# Altium schematic sheet Top.SchDoc: HPBI Controller (part 1 of 2)
size C; ApprovedBy: J Johnson; CheckedBy: J Johnson; Author: sdfasdfdfAEFfasdFfaF; DrawnBy: J Johnson; Organization: Opsero Electronic Design; Address1: 21-915 Av. Marguerite-Bourgeoys; Address2: Québec (QC); Address3: G1S 3X4; DocumentNumber: OP009-001-SCH; Revision: 1.0; SheetNumber: 01; SheetTotal: 16; Tel1: (581) 308-8830; Tel2: (581) 308-8830; Project: HPBI Controller; CheckedDate: yyyy-mm-dd; Sheet: Block diagram; PageSetup: Record=PageOptions|CenterHorizontal=True|CenterVertical=True|PrintScale=1.08|XCorrection=1.00|YCorrection=1.00|PrintKind=0|BorderSize=5000000|LeftOffset=0|BottomOffset=0|Orientation=2|PaperLength=1000|PaperWidth=1000|Scale=100|PaperSource=7|PrintQuality=-4|MediaType=1|DitherType=10|PaperKind=Tabloid     [11 x 17 in]|PrintScaleMode=1; DrawDate: 2013-12-13; SchTitle: HPBI Controller; RevDescription: Preliminary; RevDate: 2014-01-29; RevBy: J Johnson
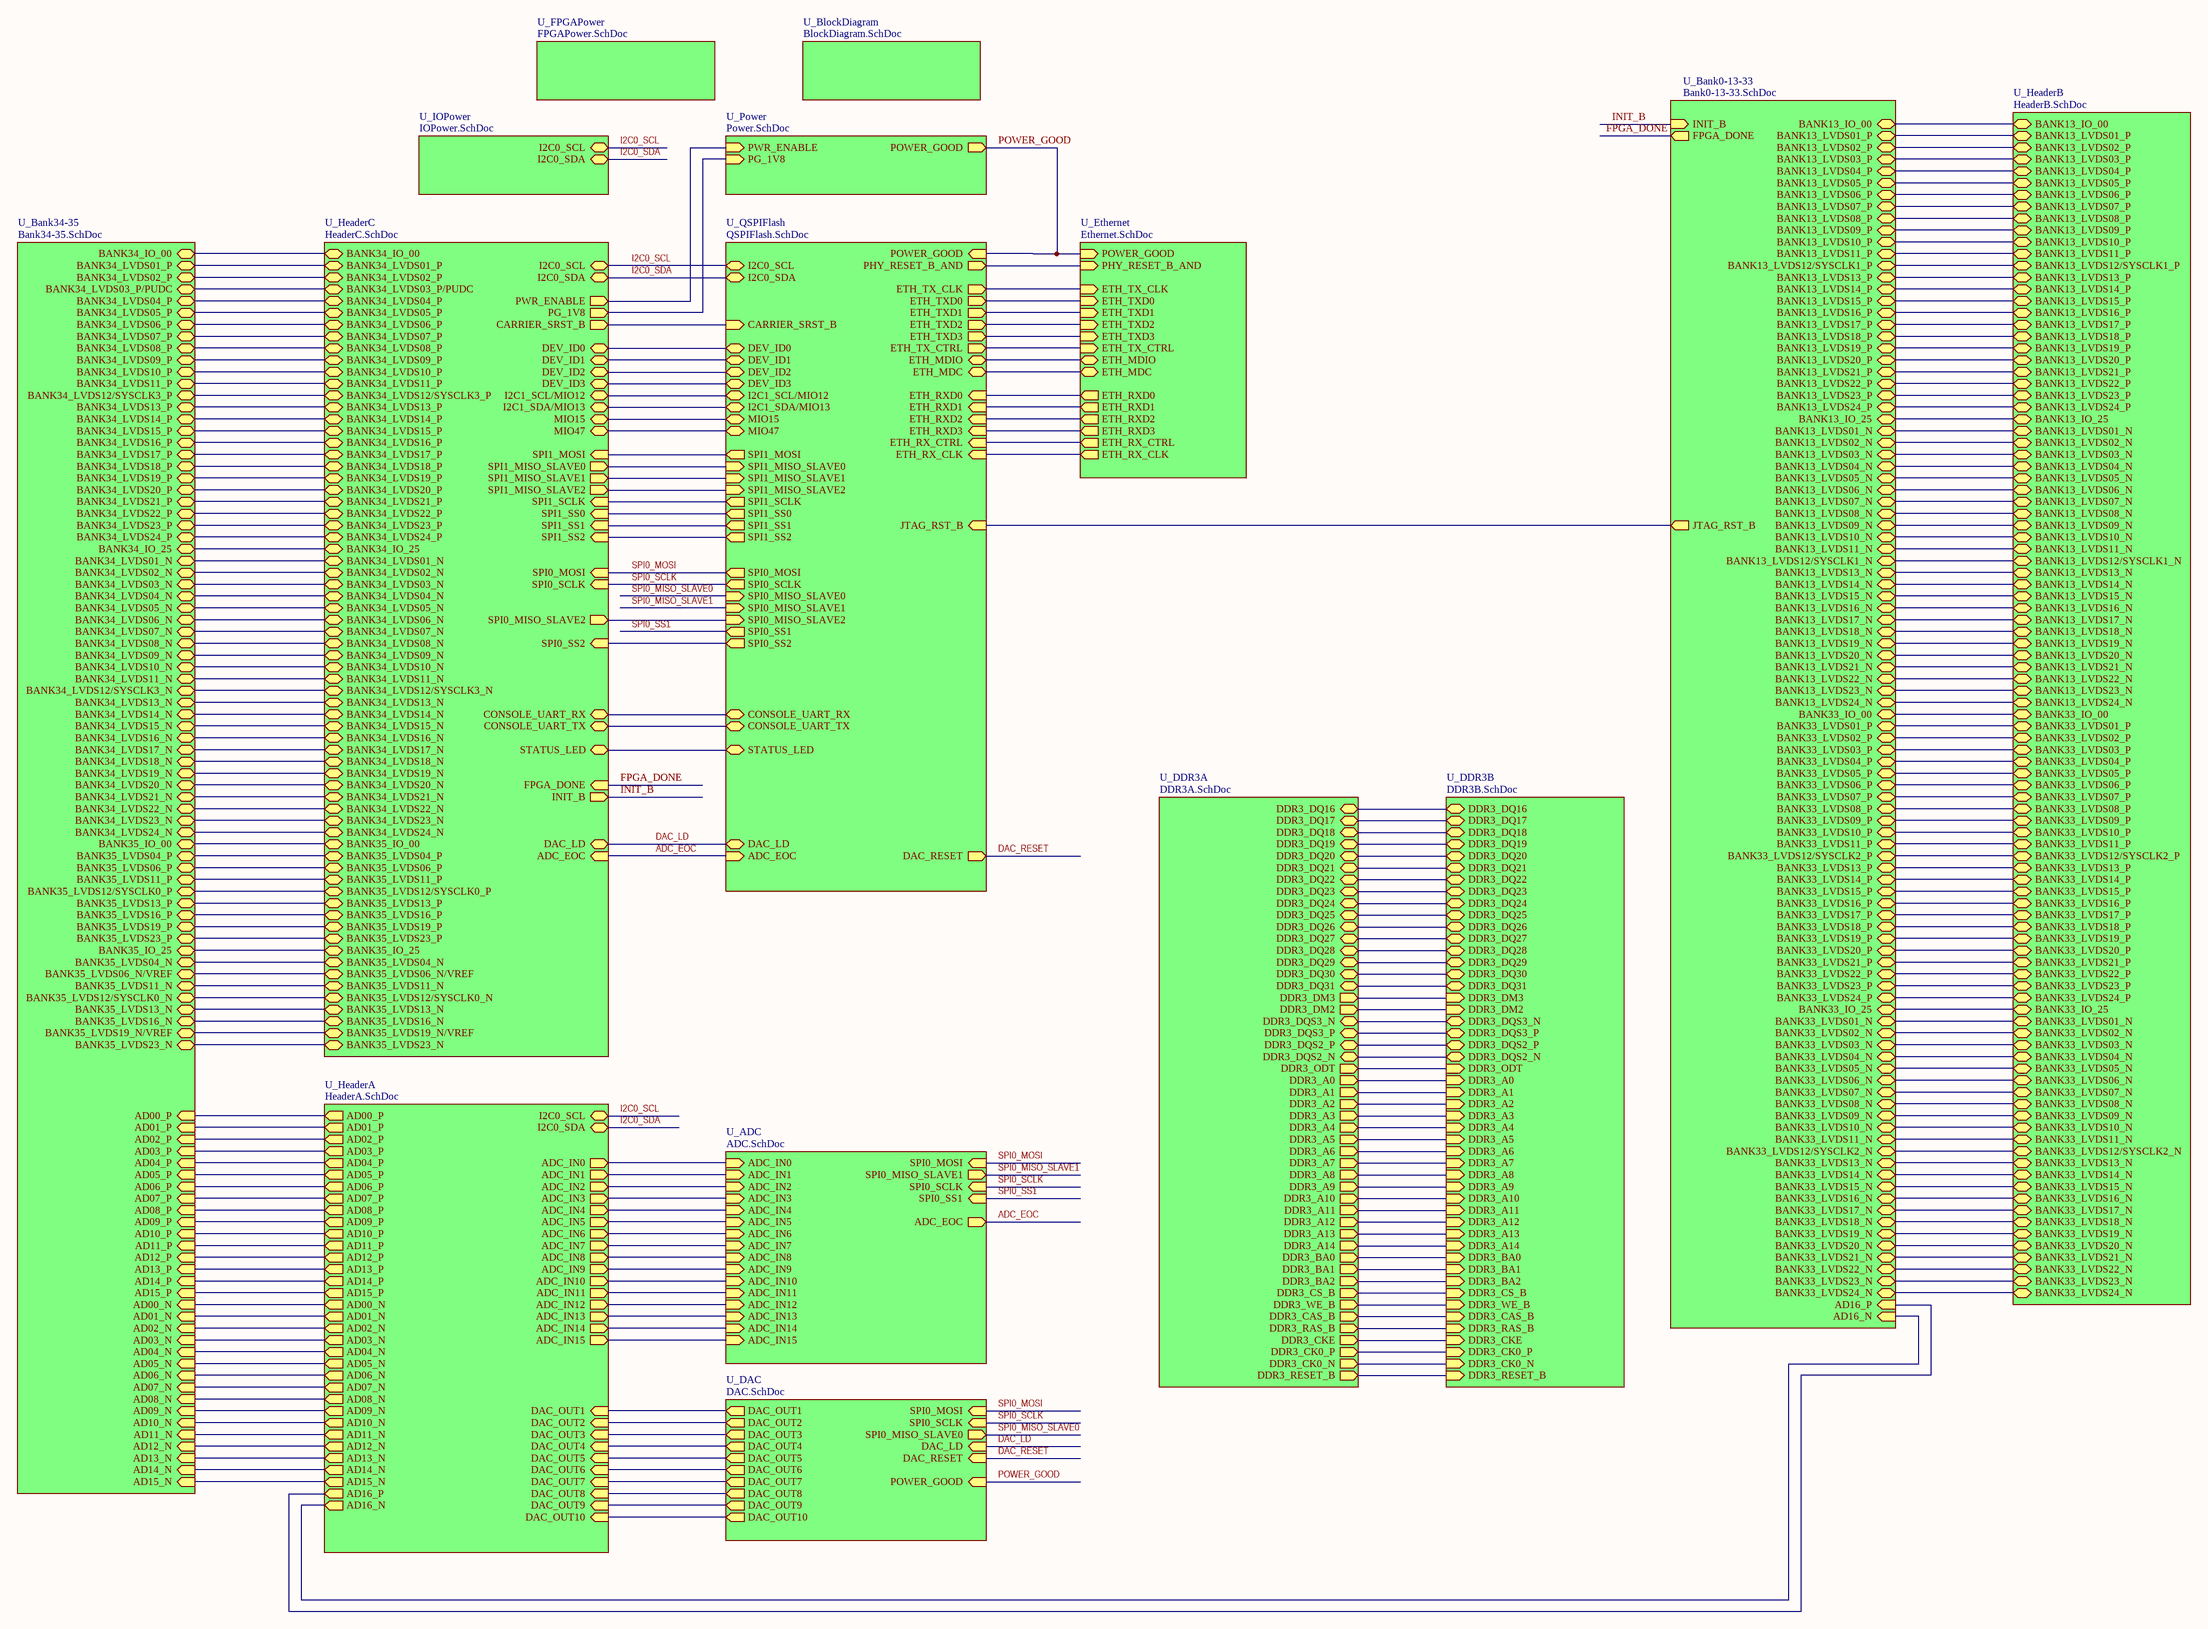
[diagram p0: Top.SchDoc]

## Sub-sheets
U_ADC = ADC.SchDoc: SPI0_MOSI (in), SPI0_MISO_SLAVE1 (out), SPI0_SCLK (in), SPI0_SS1 (in), ADC_IN0 (in), ADC_IN1 (in), ADC_IN2 (in), ADC_IN3 (in), ADC_IN4 (in), ADC_IN5 (in), ADC_IN6 (in), ADC_IN7 (in), ADC_IN8 (in), ADC_IN9 (in), ADC_IN10 (in), ADC_IN11 (in), ADC_IN12 (in), ADC_IN13 (in), ADC_IN14 (in), ADC_IN15 (in), ADC_EOC (out)
U_Bank0-13-33 = Bank0-13-33.SchDoc: FPGA_DONE (out), INIT_B (in), BANK13_IO_00 (bidir), BANK13_LVDS01_P (bidir), BANK13_LVDS02_P (bidir), BANK13_LVDS03_P (bidir), BANK13_LVDS04_P (bidir), BANK13_LVDS05_P (bidir), BANK13_LVDS06_P (bidir), BANK13_LVDS07_P (bidir), BANK13_LVDS08_P (bidir), BANK13_LVDS09_P (bidir), BANK13_LVDS10_P (bidir), BANK13_LVDS11_P (bidir), BANK13_LVDS13_P (bidir), BANK13_LVDS14_P (bidir), BANK13_LVDS15_P (bidir), BANK13_LVDS16_P (bidir), BANK13_LVDS17_P (bidir), BANK13_LVDS18_P (bidir), BANK13_LVDS19_P (bidir), BANK13_LVDS20_P (bidir), BANK13_LVDS21_P (bidir), BANK13_LVDS22_P (bidir), BANK13_LVDS23_P (bidir), BANK13_LVDS24_P (bidir), BANK13_IO_25 (bidir), BANK13_LVDS01_N (bidir), BANK13_LVDS02_N (bidir), BANK13_LVDS03_N (bidir), BANK13_LVDS04_N (bidir), BANK13_LVDS05_N (bidir), BANK13_LVDS06_N (bidir), BANK13_LVDS07_N (bidir), BANK13_LVDS08_N (bidir), BANK13_LVDS09_N (bidir), BANK13_LVDS10_N (bidir), BANK13_LVDS11_N (bidir), BANK13_LVDS13_N (bidir), BANK13_LVDS14_N (bidir), BANK13_LVDS15_N (bidir), BANK13_LVDS16_N (bidir), BANK13_LVDS17_N (bidir), BANK13_LVDS18_N (bidir), BANK13_LVDS19_N (bidir), BANK13_LVDS20_N (bidir), BANK13_LVDS21_N (bidir), BANK13_LVDS22_N (bidir), BANK13_LVDS23_N (bidir), BANK13_LVDS24_N (bidir), BANK33_IO_00 (bidir), BANK33_LVDS01_P (bidir), BANK33_LVDS02_P (bidir), BANK33_LVDS03_P (bidir), BANK33_LVDS04_P (bidir), BANK33_LVDS05_P (bidir), BANK33_LVDS06_P (bidir), BANK33_LVDS07_P (bidir), BANK33_LVDS08_P (bidir), BANK33_LVDS09_P (bidir), BANK33_LVDS10_P (bidir), BANK33_LVDS11_P (bidir), BANK33_LVDS13_P (bidir), BANK33_LVDS14_P (bidir), BANK33_LVDS15_P (bidir), BANK33_LVDS16_P (bidir), BANK33_LVDS17_P (bidir), BANK33_LVDS18_P (bidir), BANK33_LVDS19_P (bidir), BANK33_LVDS20_P (bidir), BANK33_LVDS21_P (bidir), BANK33_LVDS22_P (bidir), BANK33_LVDS23_P (bidir), BANK33_LVDS24_P (bidir), BANK33_IO_25 (bidir), BANK33_LVDS01_N (bidir), BANK33_LVDS02_N (bidir), BANK33_LVDS03_N (bidir), BANK33_LVDS04_N (bidir), BANK33_LVDS05_N (bidir), BANK33_LVDS06_N (bidir), BANK33_LVDS07_N (bidir), BANK33_LVDS08_N (bidir), BANK33_LVDS09_N (bidir), BANK33_LVDS10_N (bidir), BANK33_LVDS11_N (bidir), BANK33_LVDS13_N (bidir), BANK33_LVDS14_N (bidir), BANK33_LVDS15_N (bidir), BANK33_LVDS16_N (bidir), BANK33_LVDS17_N (bidir), BANK33_LVDS18_N (bidir), BANK33_LVDS19_N (bidir), BANK33_LVDS20_N (bidir), BANK33_LVDS21_N (bidir), BANK33_LVDS22_N (bidir), BANK33_LVDS23_N (bidir), BANK33_LVDS24_N (bidir), AD16_P (in), AD16_N (in), JTAG_RST_B (out), BANK13_LVDS12/SYSCLK1_P (bidir), BANK13_LVDS12/SYSCLK1_N (bidir), BANK33_LVDS12/SYSCLK2_P (bidir), BANK33_LVDS12/SYSCLK2_N (bidir)
U_Bank34-35 = Bank34-35.SchDoc: BANK34_IO_00 (bidir), BANK34_LVDS01_P (bidir), BANK34_LVDS02_P (bidir), BANK34_LVDS03_P/PUDC (bidir), BANK34_LVDS04_P (bidir), BANK34_LVDS05_P (bidir), BANK34_LVDS06_P (bidir), BANK34_LVDS07_P (bidir), BANK34_LVDS08_P (bidir), BANK34_LVDS09_P (bidir), BANK34_LVDS10_P (bidir), BANK34_LVDS11_P (bidir), BANK34_LVDS13_P (bidir), BANK34_LVDS14_P (bidir), BANK34_LVDS15_P (bidir), BANK34_LVDS16_P (bidir), BANK34_LVDS17_P (bidir), BANK34_LVDS18_P (bidir), BANK34_LVDS19_P (bidir), BANK34_LVDS20_P (bidir), BANK34_LVDS21_P (bidir), BANK34_LVDS22_P (bidir), BANK34_LVDS23_P (bidir), BANK34_LVDS24_P (bidir), BANK34_IO_25 (bidir), BANK34_LVDS01_N (bidir), BANK34_LVDS02_N (bidir), BANK34_LVDS03_N (bidir), BANK34_LVDS04_N (bidir), BANK34_LVDS05_N (bidir), BANK34_LVDS06_N (bidir), BANK34_LVDS07_N (bidir), BANK34_LVDS08_N (bidir), BANK34_LVDS09_N (bidir), BANK34_LVDS10_N (bidir), BANK34_LVDS11_N (bidir), BANK34_LVDS13_N (bidir), BANK34_LVDS14_N (bidir), BANK34_LVDS15_N (bidir), BANK34_LVDS16_N (bidir), BANK34_LVDS17_N (bidir), BANK34_LVDS18_N (bidir), BANK34_LVDS19_N (bidir), BANK34_LVDS20_N (bidir), BANK34_LVDS21_N (bidir), BANK34_LVDS22_N (bidir), BANK34_LVDS23_N (bidir), BANK34_LVDS24_N (bidir), BANK35_IO_00 (bidir), BANK35_LVDS04_P (bidir), BANK35_LVDS06_P (bidir), BANK35_LVDS11_P (bidir), BANK35_LVDS13_P (bidir), BANK35_LVDS16_P (bidir), BANK35_LVDS19_P (bidir), BANK35_LVDS23_P (bidir), BANK35_IO_25 (bidir), BANK35_LVDS04_N (bidir), BANK35_LVDS06_N/VREF (bidir), BANK35_LVDS11_N (bidir), BANK35_LVDS13_N (bidir), BANK35_LVDS16_N (bidir), BANK35_LVDS19_N/VREF (bidir), BANK35_LVDS23_N (bidir), AD00_P (in), AD01_P (in), AD02_P (in), AD03_P (in), AD04_P (in), AD05_P (in), AD06_P (in), AD07_P (in), AD08_P (in), AD09_P (in), AD10_P (in), AD11_P (in), AD12_P (in), AD13_P (in), AD14_P (in), AD15_P (in), AD00_N (in), AD01_N (in), AD02_N (in), AD03_N (in), AD04_N (in), AD05_N (in), AD06_N (in), AD07_N (in), AD08_N (in), AD09_N (in), AD10_N (in), AD11_N (in), AD12_N (in), AD13_N (in), AD14_N (in), AD15_N (in), BANK34_LVDS12/SYSCLK3_P (bidir), BANK34_LVDS12/SYSCLK3_N (bidir), BANK35_LVDS12/SYSCLK0_P (bidir), BANK35_LVDS12/SYSCLK0_N (bidir)
U_BlockDiagram = BlockDiagram.SchDoc: no entries
U_DAC = DAC.SchDoc: DAC_OUT1 (out), DAC_OUT2 (out), DAC_OUT3 (out), DAC_OUT4 (out), DAC_OUT5 (out), DAC_OUT6 (out), DAC_OUT7 (out), DAC_OUT8 (out), DAC_OUT9 (out), DAC_OUT10 (out), SPI0_MOSI (in), SPI0_SCLK (in), DAC_LD (in), POWER_GOOD (in), SPI0_MISO_SLAVE0 (out), DAC_RESET (in)
U_DDR3A = DDR3A.SchDoc: DDR3_DQ16 (bidir), DDR3_DQ17 (bidir), DDR3_DQ18 (bidir), DDR3_DQ19 (bidir), DDR3_DQ20 (bidir), DDR3_DQ21 (bidir), DDR3_DQ22 (bidir), DDR3_DQ23 (bidir), DDR3_DQ24 (bidir), DDR3_DQ25 (bidir), DDR3_DQ26 (bidir), DDR3_DQ27 (bidir), DDR3_DQ28 (bidir), DDR3_DQ29 (bidir), DDR3_DQ30 (bidir), DDR3_DQ31 (bidir), DDR3_DM2 (out), DDR3_DM3 (out), DDR3_DQS2_P (bidir), DDR3_DQS2_N (bidir), DDR3_DQS3_N (bidir), DDR3_DQS3_P (bidir), DDR3_A0 (out), DDR3_A1 (out), DDR3_A2 (out), DDR3_A3 (out), DDR3_A4 (out), DDR3_A5 (out), DDR3_A6 (out), DDR3_A7 (out), DDR3_A8 (out), DDR3_A9 (out), DDR3_A10 (out), DDR3_A11 (out), DDR3_A12 (out), DDR3_A13 (out), DDR3_A14 (out), DDR3_BA0 (out), DDR3_BA1 (out), DDR3_BA2 (out), DDR3_CK0_P (out), DDR3_CK0_N (out), DDR3_CKE (out), DDR3_CS_B (out), DDR3_RAS_B (out), DDR3_CAS_B (out), DDR3_WE_B (out), DDR3_ODT (out), DDR3_RESET_B (out)
U_DDR3B = DDR3B.SchDoc: DDR3_DQ24 (bidir), DDR3_DQ25 (bidir), DDR3_DQ26 (bidir), DDR3_DQ27 (bidir), DDR3_DQ28 (bidir), DDR3_DQ29 (bidir), DDR3_DQ30 (bidir), DDR3_DQ31 (bidir), DDR3_DQ16 (bidir), DDR3_DQ17 (bidir), DDR3_DQ18 (bidir), DDR3_DQ19 (bidir), DDR3_DQ20 (bidir), DDR3_DQ21 (bidir), DDR3_DQ22 (bidir), DDR3_DQ23 (bidir), DDR3_DM3 (in), DDR3_DM2 (in), DDR3_DQS3_N (bidir), DDR3_DQS3_P (bidir), DDR3_DQS2_P (bidir), DDR3_DQS2_N (bidir), DDR3_ODT (in), DDR3_A0 (in), DDR3_A1 (in), DDR3_A2 (in), DDR3_A3 (in), DDR3_A4 (in), DDR3_A5 (in), DDR3_A6 (in), DDR3_A7 (in), DDR3_A8 (in), DDR3_A9 (in), DDR3_A10 (in), DDR3_A11 (in), DDR3_A12 (in), DDR3_A13 (in), DDR3_A14 (in), DDR3_BA0 (in), DDR3_BA1 (in), DDR3_BA2 (in), DDR3_CS_B (in), DDR3_WE_B (in), DDR3_CAS_B (in), DDR3_RAS_B (in), DDR3_CKE (in), DDR3_CK0_P (in), DDR3_CK0_N (in), DDR3_RESET_B (in)
U_Ethernet = Ethernet.SchDoc: POWER_GOOD (in), ETH_TX_CLK (in), ETH_TXD0 (in), ETH_TXD1 (in), ETH_TXD2 (in), ETH_TXD3 (in), ETH_RXD0 (out), ETH_RXD1 (out), ETH_RXD2 (out), ETH_RXD3 (out), ETH_TX_CTRL (in), ETH_RX_CTRL (out), ETH_RX_CLK (out), ETH_MDIO (bidir), ETH_MDC (bidir), PHY_RESET_B_AND (in)
U_FPGAPower = FPGAPower.SchDoc: no entries
U_HeaderA = HeaderA.SchDoc: AD00_P (out), AD01_P (out), AD02_P (out), AD03_P (out), AD04_P (out), AD05_P (out), AD06_P (out), AD07_P (out), AD08_P (out), AD09_P (out), AD10_P (out), AD11_P (out), AD12_P (out), AD13_P (out), AD14_P (out), AD15_P (out), AD00_N (out), AD01_N (out), AD02_N (out), AD03_N (out), AD04_N (out), AD05_N (out), AD06_N (out), AD07_N (out), AD08_N (out), AD09_N (out), AD10_N (out), AD11_N (out), AD12_N (out), AD13_N (out), AD14_N (out), AD15_N (out), AD16_P (out), AD16_N (out), DAC_OUT1 (in), DAC_OUT2 (in), DAC_OUT3 (in), DAC_OUT4 (in), DAC_OUT5 (in), DAC_OUT6 (in), DAC_OUT7 (in), DAC_OUT8 (in), DAC_OUT9 (in), DAC_OUT10 (in), ADC_IN0 (out), ADC_IN1 (out), ADC_IN2 (out), ADC_IN3 (out), ADC_IN4 (out), ADC_IN5 (out), ADC_IN6 (out), ADC_IN7 (out), ADC_IN8 (out), ADC_IN9 (out), ADC_IN10 (out), ADC_IN11 (out), ADC_IN12 (out), ADC_IN13 (out), ADC_IN14 (out), ADC_IN15 (out), I2C0_SCL (bidir), I2C0_SDA (bidir)
U_HeaderB = HeaderB.SchDoc: BANK13_IO_00 (bidir), BANK13_LVDS01_P (bidir), BANK13_LVDS02_P (bidir), BANK13_LVDS03_P (bidir), BANK13_LVDS04_P (bidir), BANK13_LVDS05_P (bidir), BANK13_LVDS06_P (bidir), BANK13_LVDS07_P (bidir), BANK13_LVDS08_P (bidir), BANK13_LVDS09_P (bidir), BANK13_LVDS10_P (bidir), BANK13_LVDS11_P (bidir), BANK13_LVDS12/SYSCLK1_P (bidir), BANK13_LVDS13_P (bidir), BANK13_LVDS14_P (bidir), BANK13_LVDS15_P (bidir), BANK13_LVDS16_P (bidir), BANK13_LVDS17_P (bidir), BANK13_LVDS18_P (bidir), BANK13_LVDS19_P (bidir), BANK13_LVDS20_P (bidir), BANK13_LVDS21_P (bidir), BANK13_LVDS22_P (bidir), BANK13_LVDS23_P (bidir), BANK13_LVDS24_P (bidir), BANK13_IO_25 (bidir), BANK13_LVDS01_N (bidir), BANK13_LVDS02_N (bidir), BANK13_LVDS03_N (bidir), BANK13_LVDS04_N (bidir), BANK13_LVDS05_N (bidir), BANK13_LVDS06_N (bidir), BANK13_LVDS07_N (bidir), BANK13_LVDS08_N (bidir), BANK13_LVDS09_N (bidir), BANK13_LVDS10_N (bidir), BANK13_LVDS11_N (bidir), BANK13_LVDS12/SYSCLK1_N (bidir), BANK13_LVDS13_N (bidir), BANK13_LVDS14_N (bidir), BANK13_LVDS15_N (bidir), BANK13_LVDS16_N (bidir), BANK13_LVDS17_N (bidir), BANK13_LVDS18_N (bidir), BANK13_LVDS19_N (bidir), BANK13_LVDS20_N (bidir), BANK13_LVDS21_N (bidir), BANK13_LVDS22_N (bidir), BANK13_LVDS23_N (bidir), BANK13_LVDS24_N (bidir), BANK33_IO_00 (bidir), BANK33_LVDS01_P (bidir), BANK33_LVDS02_P (bidir), BANK33_LVDS03_P (bidir), BANK33_LVDS04_P (bidir), BANK33_LVDS05_P (bidir), BANK33_LVDS06_P (bidir), BANK33_LVDS07_P (bidir), BANK33_LVDS08_P (bidir), BANK33_LVDS09_P (bidir), BANK33_LVDS10_P (bidir), BANK33_LVDS11_P (bidir), BANK33_LVDS12/SYSCLK2_P (bidir), BANK33_LVDS13_P (bidir), BANK33_LVDS14_P (bidir), BANK33_LVDS15_P (bidir), BANK33_LVDS16_P (bidir), BANK33_LVDS17_P (bidir), BANK33_LVDS18_P (bidir), BANK33_LVDS19_P (bidir), BANK33_LVDS20_P (bidir), BANK33_LVDS21_P (bidir), BANK33_LVDS22_P (bidir), BANK33_LVDS23_P (bidir), BANK33_LVDS24_P (bidir), BANK33_IO_25 (bidir), BANK33_LVDS01_N (bidir), BANK33_LVDS02_N (bidir), BANK33_LVDS03_N (bidir), BANK33_LVDS04_N (bidir), BANK33_LVDS05_N (bidir), BANK33_LVDS06_N (bidir), BANK33_LVDS07_N (bidir), BANK33_LVDS08_N (bidir), BANK33_LVDS09_N (bidir), BANK33_LVDS10_N (bidir), BANK33_LVDS11_N (bidir), BANK33_LVDS12/SYSCLK2_N (bidir), BANK33_LVDS13_N (bidir), BANK33_LVDS14_N (bidir), BANK33_LVDS15_N (bidir), BANK33_LVDS16_N (bidir), BANK33_LVDS17_N (bidir), BANK33_LVDS18_N (bidir), BANK33_LVDS19_N (bidir), BANK33_LVDS20_N (bidir), BANK33_LVDS21_N (bidir), BANK33_LVDS22_N (bidir), BANK33_LVDS23_N (bidir), BANK33_LVDS24_N (bidir)
U_HeaderC = HeaderC.SchDoc: BANK34_IO_00 (bidir), BANK34_LVDS01_P (bidir), BANK34_LVDS02_P (bidir), BANK34_LVDS03_P/PUDC (bidir), BANK34_LVDS04_P (bidir), BANK34_LVDS05_P (bidir), BANK34_LVDS06_P (bidir), BANK34_LVDS07_P (bidir), BANK34_LVDS08_P (bidir), BANK34_LVDS09_P (bidir), BANK34_LVDS10_P (bidir), BANK34_LVDS11_P (bidir), BANK34_LVDS12/SYSCLK3_P (bidir), BANK34_LVDS13_P (bidir), BANK34_LVDS14_P (bidir), BANK34_LVDS15_P (bidir), BANK34_LVDS16_P (bidir), BANK34_LVDS17_P (bidir), BANK34_LVDS18_P (bidir), BANK34_LVDS19_P (bidir), BANK34_LVDS20_P (bidir), BANK34_LVDS21_P (bidir), BANK34_LVDS22_P (bidir), BANK34_LVDS23_P (bidir), BANK34_LVDS24_P (bidir), BANK34_IO_25 (bidir), BANK34_LVDS01_N (bidir), BANK34_LVDS02_N (bidir), BANK34_LVDS03_N (bidir), BANK34_LVDS04_N (bidir), BANK34_LVDS05_N (bidir), BANK34_LVDS06_N (bidir), BANK34_LVDS07_N (bidir), BANK34_LVDS08_N (bidir), BANK34_LVDS09_N (bidir), BANK34_LVDS10_N (bidir), BANK34_LVDS11_N (bidir), BANK34_LVDS12/SYSCLK3_N (bidir), BANK34_LVDS13_N (bidir), BANK34_LVDS14_N (bidir), BANK34_LVDS15_N (bidir), BANK34_LVDS16_N (bidir), BANK34_LVDS17_N (bidir), BANK34_LVDS18_N (bidir), BANK34_LVDS19_N (bidir), BANK34_LVDS20_N (bidir), BANK34_LVDS21_N (bidir), BANK34_LVDS22_N (bidir), BANK34_LVDS23_N (bidir), BANK34_LVDS24_N (bidir), BANK35_IO_00 (bidir), BANK35_LVDS04_P (bidir), BANK35_LVDS06_P (bidir), BANK35_LVDS11_P (bidir), BANK35_LVDS12/SYSCLK0_P (bidir), BANK35_LVDS13_P (bidir), BANK35_LVDS16_P (bidir), BANK35_LVDS19_P (bidir), BANK35_LVDS23_P (bidir), BANK35_IO_25 (bidir), BANK35_LVDS04_N (bidir), BANK35_LVDS06_N/VREF (bidir), BANK35_LVDS11_N (bidir), BANK35_LVDS12/SYSCLK0_N (bidir), BANK35_LVDS13_N (bidir), BANK35_LVDS16_N (bidir), BANK35_LVDS19_N/VREF (bidir), BANK35_LVDS23_N (bidir), DEV_ID0 (bidir), DEV_ID1 (bidir), DEV_ID2 (bidir), I2C1_SCL/MIO12 (bidir), I2C1_SDA/MIO13 (bidir), DAC_LD (bidir), ADC_EOC (in), SPI1_MOSI (in), SPI1_SCLK (in), SPI1_SS0 (in), SPI1_SS1 (in), SPI1_SS2 (in), CONSOLE_UART_RX (bidir), CONSOLE_UART_TX (bidir), I2C0_SCL (bidir), I2C0_SDA (bidir), DEV_ID3 (bidir), CARRIER_SRST_B (out), STATUS_LED (bidir), FPGA_DONE (in), INIT_B (out), PWR_ENABLE (out), PG_1V8 (out), MIO15 (bidir), SPI1_MISO_SLAVE0 (out), SPI1_MISO_SLAVE1 (out), SPI1_MISO_SLAVE2 (out), SPI0_MOSI (in), SPI0_SCLK (in), SPI0_SS2 (in), SPI0_MISO_SLAVE2 (out), MIO47 (bidir)
U_IOPower = IOPower.SchDoc: I2C0_SCL (bidir), I2C0_SDA (bidir)
U_Power = Power.SchDoc: PWR_ENABLE (in), POWER_GOOD (out), PG_1V8 (in)
U_QSPIFlash = QSPIFlash.SchDoc: JTAG_RST_B (in), CARRIER_SRST_B (in), ETH_TX_CLK (out), ETH_TXD0 (out), ETH_TXD1 (out), ETH_TXD2 (out), ETH_TXD3 (out), ETH_RXD0 (in), ETH_RXD1 (in), ETH_RXD2 (in), ETH_RXD3 (in), ETH_TX_CTRL (out), ETH_RX_CTRL (in), ETH_RX_CLK (in), ETH_MDIO (bidir), ETH_MDC (bidir), PHY_RESET_B_AND (out), DEV_ID0 (bidir), DEV_ID1 (bidir), DEV_ID2 (bidir), I2C1_SCL/MIO12 (bidir), I2C1_SDA/MIO13 (bidir), DAC_LD (bidir), ADC_EOC (in), SPI0_MOSI (out), SPI0_SCLK (out), CONSOLE_UART_RX (bidir), CONSOLE_UART_TX (bidir), I2C0_SCL (bidir), I2C0_SDA (bidir), POWER_GOOD (in), DEV_ID3 (bidir), SPI1_MOSI (out), SPI1_SCLK (out), STATUS_LED (bidir), MIO15 (bidir), SPI1_MISO_SLAVE0 (in), SPI1_MISO_SLAVE1 (in), SPI1_MISO_SLAVE2 (in), SPI0_SS1 (out), SPI1_SS0 (out), SPI1_SS1 (out), SPI1_SS2 (out), SPI0_SS2 (out), SPI0_MISO_SLAVE0 (in), SPI0_MISO_SLAVE2 (in), SPI0_MISO_SLAVE1 (in), DAC_RESET (out), MIO47 (bidir)